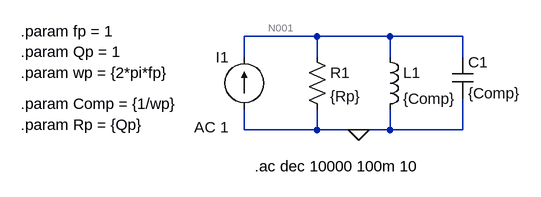
[diagram p0: schematic RLC - Paralelo.asc]
RLC - Paralelo.asc, the LTspice schematic file:
Version 4
SHEET 1 880 680
WIRE 208 80 96 80
WIRE 320 80 208 80
WIRE 432 80 320 80
WIRE 96 112 96 80
WIRE 208 112 208 80
WIRE 320 112 320 80
WIRE 432 112 432 80
WIRE 96 224 96 192
WIRE 208 224 208 192
WIRE 208 224 96 224
WIRE 272 224 208 224
WIRE 320 224 320 192
WIRE 320 224 272 224
WIRE 432 224 432 176
WIRE 432 224 320 224
FLAG 272 224 0
SYMBOL current 96 192 R180
WINDOW 0 24 80 Left 2
WINDOW 3 24 0 Left 2
WINDOW 123 24 -28 Left 2
WINDOW 39 0 0 Left 0
SYMATTR InstName I1
SYMATTR Value ""
SYMATTR Value2 AC 1
SYMBOL res 192 96 R0
SYMATTR InstName R1
SYMATTR Value {Rp}
SYMBOL ind 304 96 R0
SYMATTR InstName L1
SYMATTR Value {Comp}
SYMBOL cap 416 112 R0
SYMATTR InstName C1
SYMATTR Value {Comp}
TEXT -248 72 Left 2 !.param fp = 1
TEXT -248 104 Left 2 !.param Qp = 1
TEXT -248 136 Left 2 !.param wp = {2*pi*fp}
TEXT -248 184 Left 2 !.param Comp = {1/wp}
TEXT -248 216 Left 2 !.param Rp = {Qp}
TEXT 112 280 Left 2 !.ac dec 10000 100m 10

The netlist it stands for:
* RLC - Paralelo.asc
I1 0 N001 AC 1
R1 N001 0 {Rp}
L1 N001 0 {Comp}
C1 N001 0 {Comp}
.param fp = 1
.param Qp = 1
.param wp = {2*pi*fp}
.param Comp = {1/wp}
.param Rp = {Qp}
.ac dec 10000 100m 10
.backanno
.end

* Results of the author's LTspice run, read from the files saved beside the schematic
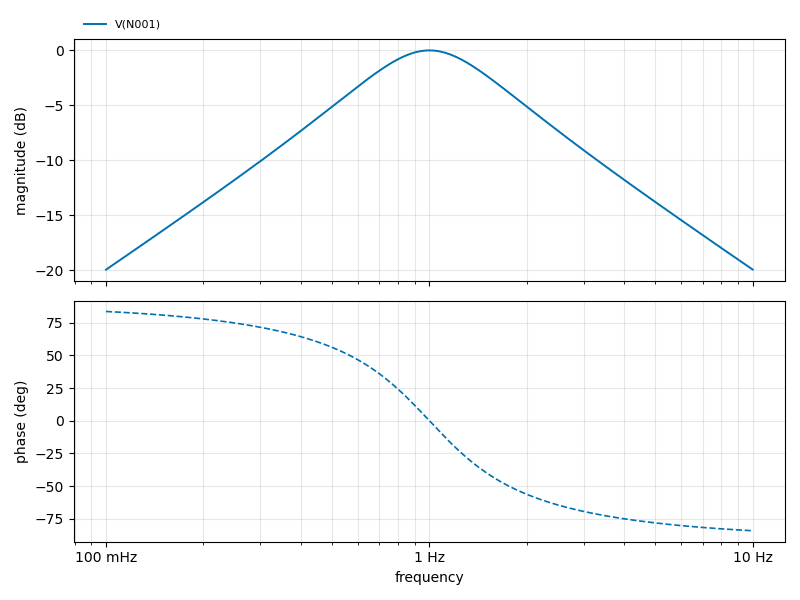
[diagram p1: AC Analysis of RLC - Paralelo.asc, plotted from the saved traces]
* AC Analysis, 1 run:
*   V(N001): -19.97 dB at 100 mHz, -19.96 dB at 10 Hz, peak -0.01 dB at 1 Hz, 3 dB below the peak at 618.2 mHz and 1.619 Hz